# EAGLE board PCB-CMB-6 (EAGLE 7.2.0), part 1 of 2
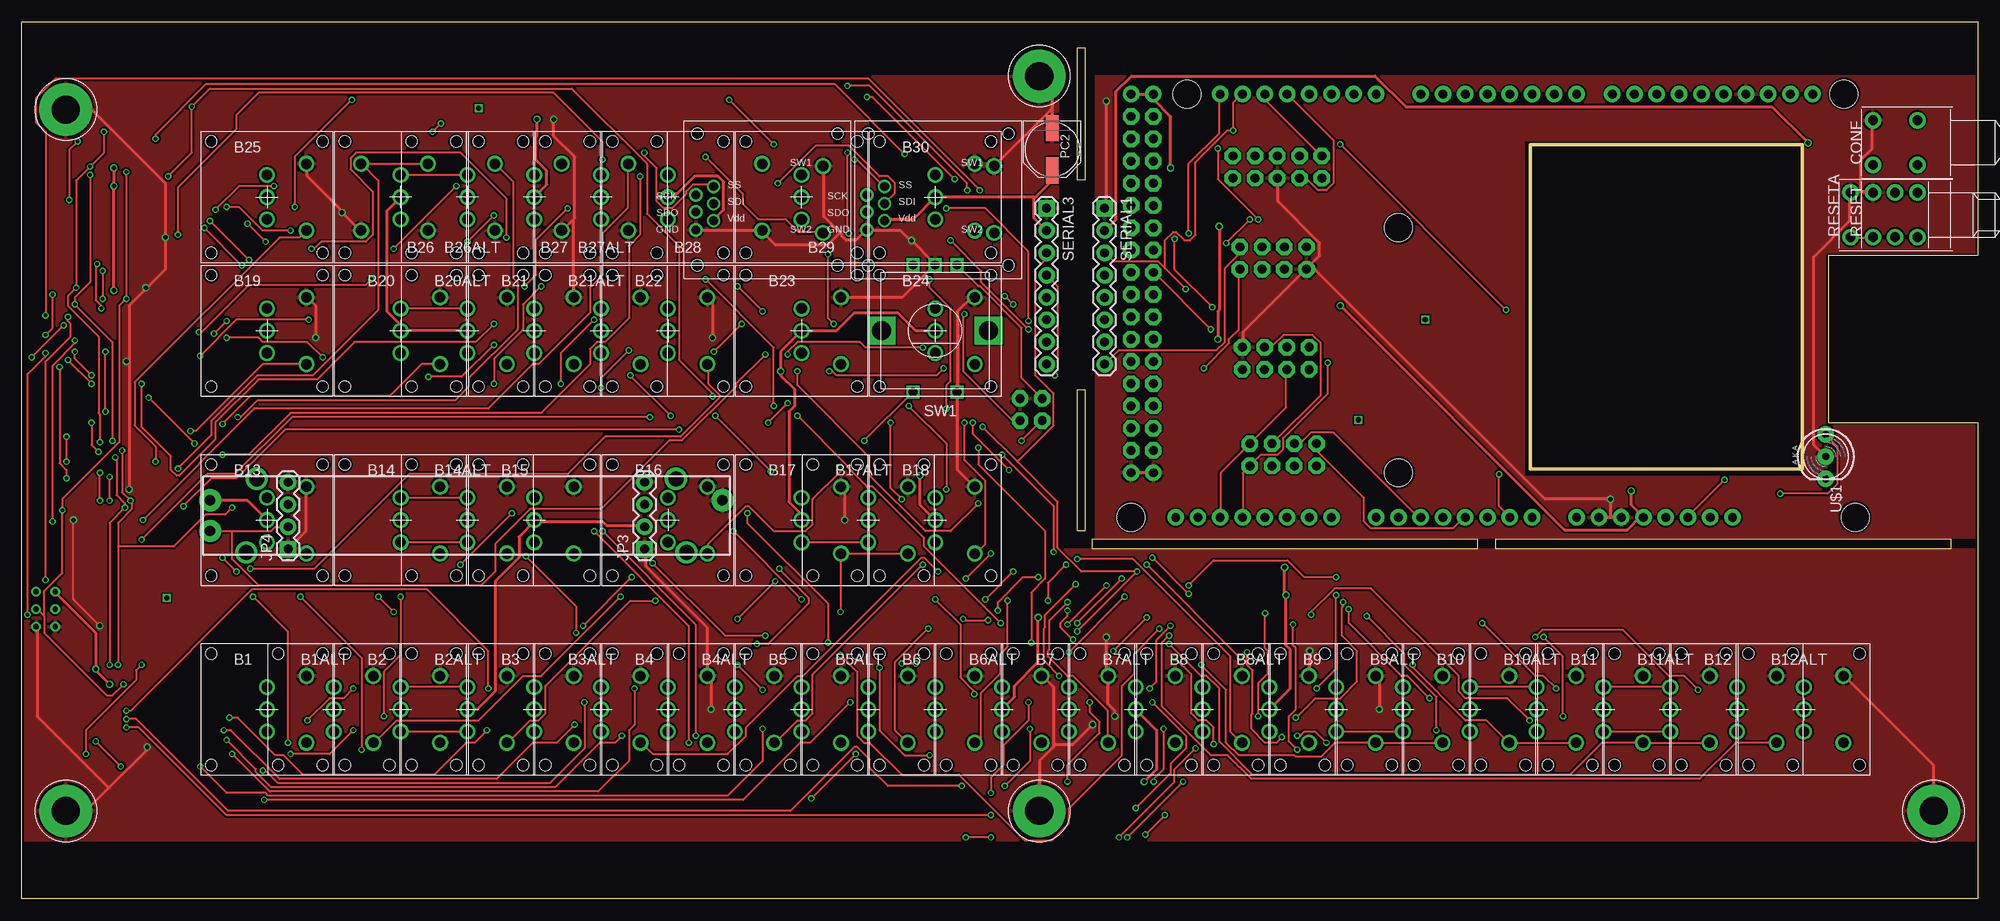
[diagram p7: board, top side]
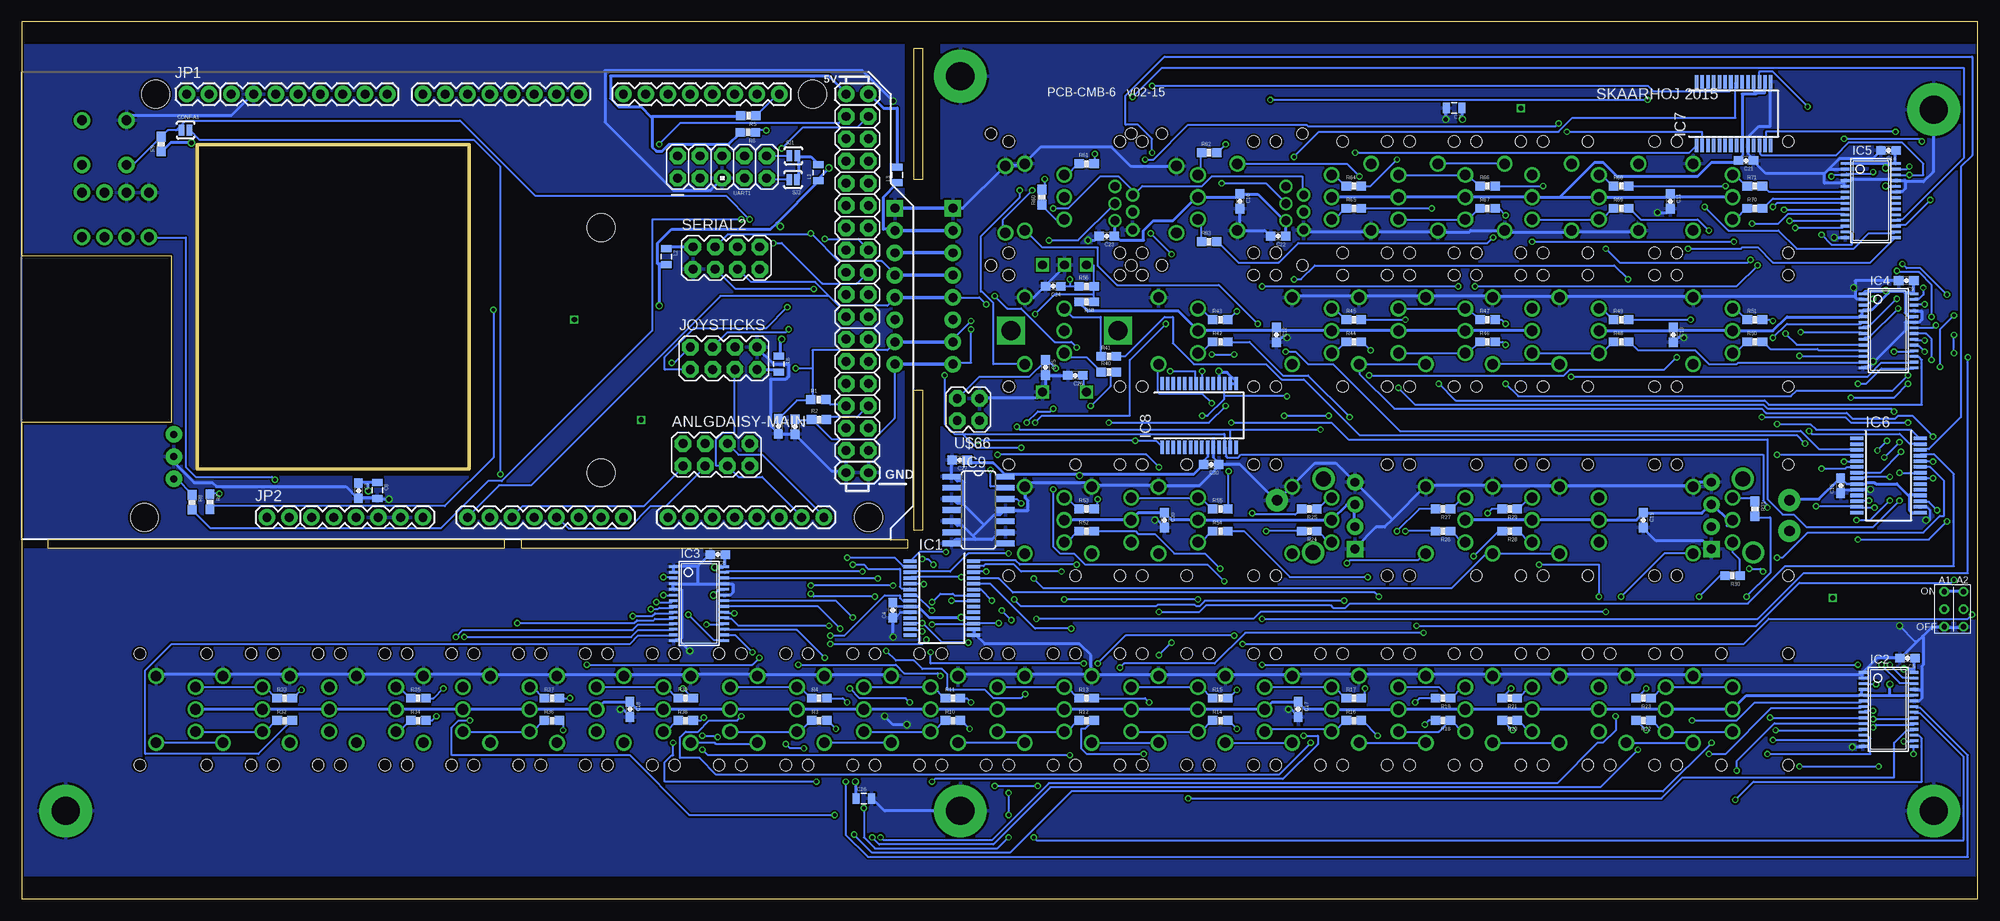
[diagram p8: board, bottom side, seen from below]

Size 223 x 100 mm. Coordinates in mm from the lower left corner, seen from the top.
Outline: 0,0 0,100 223,100 223,73.32 206,73.32 206,54.32 223,54.32 223,0 0,0
Copper layers (1*16): Top 0.035mm / dielectric 1.5mm / Bottom 0.035mm
Design rules "Fusion_eagle_rule_v1.1": minimum track width 6mil, minimum drill 12mil, track to track 6mil, track to pad 6mil, pad to pad 6mil, via to via 6mil, smd to smd 0mil, copper to edge 10mil, drill to drill 10mil, minimum pad ring 10mil, minimum via ring 6mil, stop-mask expansion 2mil, vias tented up to drill 100mil, thermal gap 10mil
Net classes: 0 default: width 0.203 mm, drill 0.406 mm, clearance 0.203 mm; 1 Power: width 0.356 mm, drill 0.508 mm, clearance 0.203 mm
tRestrict: area 0,0 to 223,6.5; area 0,94 to 223,100; area 118.3,40 to 122.3,100; area 121,40 to 223,41; area 171.4,48.3 to 203.2,86.4
bRestrict: area 0,97.5 to 223,100; area 0,0 to 223,2.5; area 118.3,40 to 122.3,100; area 121,40 to 223,41; area 171.4,48.3 to 203.2,86.4
Milling: area 168,40 to 220,41; area 120.3,82 to 121.3,97; area 120.3,42 to 121.3,58; area 122,40 to 166,41; 4 lines

## Footprints (pad centres in the part's own frame; a part is rotated, then mirrored left to right if it is on the bottom)
2X4 = drill 1.016 pad 1.88 octagon: 1 -3.81,-1.27; 2 -3.81,1.27; 3 -1.27,-1.27; 4 -1.27,1.27; 5 1.27,-1.27; 6 1.27,1.27; 7 3.81,-1.27; 8 3.81,1.27
LP11 = drill 1.2: COM 0,0; P$2 0,2.54; P$3 0,-2.54; P$4 4.5,3.81; P$5 4.5,-3.81 | hole 1.3: -6.35,6.35; 6.35,6.35; 6.35,-6.35; -6.35,-6.35
0603-CAP = smd 1.1 x 1: 1 -0.85,0; 2 0.85,0
0805 = smd 0.8 x 1.2: 1 -0.9,0; 2 0.9,0
PUSHBUTTON = drill 1.1 pad 1.88: 1 2.54,2.54; 2 2.54,-2.54; 3 -2.54,2.54; 4 -2.54,-2.54
SJ_2S-NO = smd 0.635 x 1.27: 1 -0.45,0; 2 0.45,0
SSOP28 = smd 0.4 x 1.5: 1 -4.225,-3.625; 2 -3.575,-3.625; 3 -2.925,-3.625; 4 -2.275,-3.625; 5 -1.625,-3.625; 6 -0.975,-3.625; 7 -0.325,-3.625; 8 0.325,-3.625; 9 0.975,-3.625; 10 1.625,-3.625; 11 2.275,-3.625; 12 2.925,-3.625; 13 3.575,-3.625; 14 4.225,-3.625; 15 4.225,3.625; 16 3.575,3.625; 17 2.925,3.625; 18 2.275,3.625; 19 1.625,3.625; 20 0.975,3.625; 21 0.325,3.625; 22 -0.325,3.625; 23 -0.975,3.625; 24 -1.625,3.625; 25 -2.275,3.625; 26 -2.925,3.625; 27 -3.575,3.625; 28 -4.225,3.625
TSSOP28 = smd 0.305 x 0.991: 1 -4.225,-2.918; 2 -3.575,-2.918; 3 -2.925,-2.918; 4 -2.275,-2.918; 5 -1.625,-2.918; 6 -0.975,-2.918; 7 -0.325,-2.918; 8 0.325,-2.918; 9 0.975,-2.918; 10 1.625,-2.918; 11 2.275,-2.918; 12 2.925,-2.918; 13 3.575,-2.918; 14 4.225,-2.918; 15 4.225,2.918; 16 3.575,2.918; 17 2.925,2.918; 18 2.275,2.918; 19 1.625,2.918; 20 0.975,2.918; 21 0.325,2.918; 22 -0.325,2.918; 23 -0.975,2.918; 24 -1.625,2.918; 25 -2.275,2.918; 26 -2.925,2.918; 27 -3.575,2.918; 28 -4.225,2.918
SO14 = smd 0.66 x 2.032: 1 -3.81,-3.073; 2 -2.54,-3.073; 3 -1.27,-3.073; 4 0,-3.073; 5 1.27,-3.073; 6 2.54,-3.073; 7 3.81,-3.073; 8 3.81,3.073; 9 2.54,3.073; 10 1.27,3.073; 11 0,3.073; 12 -1.27,3.073; 13 -2.54,3.073; 14 -3.81,3.073
1X02 = drill 1.016 pad 1.88: 1 0,0; 2 2.54,0
1X04 = drill 1.016 pad 1.88 square: 1 0,0 | drill 1.016 pad 1.88: 2 2.54,0; 3 5.08,0; 4 7.62,0
PANASONIC_D = smd 3 x 1.4: + 2.4,0; - -2.4,0
SLIDER45 = drill 1.194 pad 2.54: 1 -29.21,1.75; 2A -29.21,-1.75; 3 29.21,1.75 | drill 1.702: P$1 -23.9,4.2; P$2 23.9,4.2; P$3 25.1,-4.2; P$4 -25.1,-4.2
0603-RES = smd 1.1 x 1: 1 -0.85,0; 2 0.85,0
1X08 = drill 1.016 pad 1.88 square: 1 0,0 | drill 1.016 pad 1.88: 2 2.54,0; 3 5.08,0; 4 7.62,0; 5 10.16,0; 6 12.7,0; 7 15.24,0; 8 17.78,0
SMART_SWITCH = drill 1.2: 1 6.35,3.81; 2 6.35,-3.81 | drill 1: 3 -8.153,-3.48; 4 -6.147,-2.413; 5 -8.153,-1.422; 6 -6.147,-0.483; 7 -8.153,0.508; 8 -6.147,1.499 | hole 1.3: -8.001,7.506; 8.001,7.506; 8.001,-7.506; -8.001,-7.506
ALPS_EC12E_SW = drill 1 square: A -2.5,-7.5; B 2.5,-7.5; C 0,-7.5; D -2.5,7; E 2.5,7 | drill 2.2 square: GND1 -6.1,0; GND2 6.1,0
ARDUINO_MEGA = drill 1.016 pad 1.88: 0 63.5,50.8; 1 60.96,50.8; 2 58.42,50.8; 3 55.88,50.8; 3.3V 35.56,2.54; 4 53.34,50.8; 5 50.8,50.8; 5V@0 38.1,2.54; 5V@1 93.98,50.8; 5V@2 96.52,50.8; 6 48.26,50.8; 7 45.72,50.8; 8 41.656,50.8; 9 39.116,50.8; 10 36.576,50.8; 11 34.036,50.8; 12 31.496,50.8; 13 28.956,50.8; 14 68.58,50.8; 15 71.12,50.8; 16 73.66,50.8; 17 76.2,50.8; 18 78.74,50.8; 19 81.28,50.8; 20 83.82,50.8; 21 86.36,50.8; A0 50.8,2.54; A1 53.34,2.54; A2 55.88,2.54; A3 58.42,2.54; A4 60.96,2.54; A5 63.5,2.54; A6 66.04,2.54; A7 68.58,2.54; A8 73.66,2.54; A9 76.2,2.54; A10 78.74,2.54; A11 81.28,2.54; A12 83.82,2.54; A13 86.36,2.54; A14 88.9,2.54; A15 91.44,2.54; AREF 23.876,50.8; GND@0 40.64,2.54; GND@1 43.18,2.54; GND@2 93.98,7.62; GND@3 96.52,7.62; GND@4 26.416,50.8; RESET 33.02,2.54; VIN 45.72,2.54 | drill 1.016 pad 1.88 octagon: 22 93.98,48.26; 23 96.52,48.26; 24 93.98,45.72; 25 96.52,45.72; 26 93.98,43.18; 27 96.52,43.18; 28 93.98,40.64; 29 96.52,40.64; 30 93.98,38.1; 31 96.52,38.1; 32 93.98,35.56; 33 96.52,35.56; 34 93.98,33.02; 35 96.52,33.02; 36 93.98,30.48; 37 96.52,30.48; 38 93.98,27.94; 39 96.52,27.94; 40 93.98,25.4; 41 96.52,25.4; 42 93.98,22.86; 43 96.52,22.86; 44 93.98,20.32; 45 96.52,20.32; 46 93.98,17.78; 47 96.52,17.78; 48 93.98,15.24; 49 96.52,15.24; 50 93.98,12.7; 51 96.52,12.7; 52 93.98,10.16; 53 96.52,10.16 | hole 3.2: 15.24,50.8; 13.97,2.54; 66.04,35.56; 66.04,7.62; 90.17,50.8; 96.52,2.54
LED5MM-BICOLOR = drill 0.813 pad 1.88: A2 2.54,0; A3 -2.54,0; K1 0,0
3.2MMPAD6MM = drill 3.2 pad 6: P$1 0,0
2BITADDR = drill 0.6: A1 0,0; A2 2.2,0; H2 0,2; H3 2.2,2; L2 0,-2; L3 2.2,-2
2X2 = drill 1.016 pad 1.88 octagon: 1 -3.81,-1.27; 2 -3.81,1.27; 3 -1.27,-1.27; 4 -1.27,1.27
AVR_ICSP = drill 1.016 pad 1.88 octagon: 1 -1.27,5.08; 2 1.27,5.08; 3 -1.27,2.54; 4 1.27,2.54; 5 -1.27,0; 6 1.27,0; 7 -1.27,-2.54; 8 1.27,-2.54; 9 -1.27,-5.08; 10 1.27,-5.08

## Placement (x,y rotation side)
ANLGDAISY-MAIN  M04X2  [2X4]  143.82,50.62 0 bottom
B1  LP11-B"  [LP11]  27.94,21.59 0 top
B1ALT  LP11-B"  [LP11]  35.56,21.59 0 top
B2  LP11-B"  [LP11]  43.18,21.59 0 top
B2ALT  LP11-B"  [LP11]  50.8,21.59 0 top
B3  LP11-B"  [LP11]  58.42,21.59 0 top
B3ALT  LP11-B"  [LP11]  66.04,21.59 0 top
B4  LP11-B"  [LP11]  73.66,21.59 0 top
B4ALT  LP11-B"  [LP11]  81.28,21.59 0 top
B5  LP11-B"  [LP11]  88.9,21.59 0 top
B5ALT  LP11-B"  [LP11]  96.52,21.59 0 top
B6  LP11-B"  [LP11]  104.14,21.59 0 top
B6ALT  LP11-B"  [LP11]  111.76,21.59 0 top
B7  LP11-B"  [LP11]  119.38,21.59 0 top
B7ALT  LP11-B"  [LP11]  127,21.59 0 top
B8  LP11-B"  [LP11]  134.62,21.59 0 top
B8ALT  LP11-B"  [LP11]  142.24,21.59 0 top
B9  LP11-B"  [LP11]  149.86,21.59 0 top
B9ALT  LP11-B"  [LP11]  157.48,21.59 0 top
B10  LP11-B"  [LP11]  165.1,21.59 0 top
B10ALT  LP11-B"  [LP11]  172.72,21.59 0 top
B11  LP11-B"  [LP11]  180.34,21.59 0 top
B11ALT  LP11-B"  [LP11]  187.96,21.59 0 top
B12  LP11-B"  [LP11]  195.58,21.59 0 top
B12ALT  LP11-B"  [LP11]  203.2,21.59 0 top
B13  LP11-B"  [LP11]  27.94,43.18 0 top
B14  LP11-B"  [LP11]  43.18,43.18 0 top
B14ALT  LP11-B"  [LP11]  50.8,43.18 0 top
B15  LP11-B"  [LP11]  58.42,43.18 0 top
B16  LP11-B"  [LP11]  73.66,43.18 0 top
B17  LP11-B"  [LP11]  88.9,43.18 0 top
B17ALT  LP11-B"  [LP11]  96.52,43.18 0 top
B18  LP11-B"  [LP11]  104.14,43.18 0 top
B19  LP11-B"  [LP11]  27.94,64.77 0 top
B20  LP11-B"  [LP11]  43.18,64.77 0 top
B20ALT  LP11-B"  [LP11]  50.8,64.77 0 top
B21  LP11-B"  [LP11]  58.42,64.77 0 top
B21ALT  LP11-B"  [LP11]  66.04,64.77 0 top
B22  LP11-B"  [LP11]  73.66,64.77 0 top
B23  LP11-B"  [LP11]  88.9,64.77 0 top
B24  LP11-B"  [LP11]  104.14,64.77 0 top
B25  LP11-B"  [LP11]  27.94,80.01 0 top
B26  LP11-B"  [LP11]  43.18,80.01 180 top
B26ALT  LP11-B"  [LP11]  50.8,80.01 180 top
B27  LP11-B"  [LP11]  58.42,80.01 180 top
B27ALT  LP11-B"  [LP11]  66.04,80.01 180 top
B28  LP11-B"  [LP11]  73.66,80.01 180 top
B29  LP11-B"  [LP11]  88.9,80.01 180 top
B30  LP11-B"  [LP11]  104.14,80.01 0 top
C1  220pF?  [0603-CAP]  136.75,53.89 270 bottom
C2  220pF?  [0603-CAP]  134.84,53.82 270 bottom
C3  100nF  [0603-CAP]  184.63,46.52 270 bottom
C4  100nF  [0603-CAP]  123.7,32.89 90 bottom
C5  100nF  [0603-CAP]  8,27.43 180 bottom
C6  22uF  [0805]  182.47,46.57 270 bottom
C7  22uF  [0805]  59.69,90.17 180 bottom
C8  100nF  [0603-CAP]  143.64,39.24 180 bottom
C9  100nF  [0603-CAP]  8.13,70.48 180 bottom
C10  100nF  [0603-CAP]  84.12,79.55 270 bottom
C11  100nF  [0603-CAP]  35.05,79.55 270 bottom
C12  100nF  [0603-CAP]  79.96,64.31 270 bottom
C13  100nF  [0603-CAP]  34.7,64.31 270 bottom
C14  100nF  [0603-CAP]  10.16,85.34 180 bottom
C15  100nF  [0603-CAP]  15.62,47.12 90 bottom
C16  22uF  [0805]  127,11.43 0 bottom
C17  100nF  [0603-CAP]  77.47,21.59 270 bottom
C18  100nF  [0603-CAP]  153.67,21.59 270 bottom
C19  100nF  [0603-CAP]  38.1,43.18 270 bottom
C20  100nF  [0603-CAP]  92.71,43.18 270 bottom
C21  100nF  [0603-CAP]  26.42,84.2 180 bottom
C22  100nF  [0603-CAP]  79.76,75.56 180 bottom
C23  100nF  [0603-CAP]  99.31,75.56 180 bottom
C24  10nF  [0603-CAP]  105.41,69.85 180 bottom
C25  10nF  [0603-CAP]  106.3,60.58 270 bottom
C26  10nF  [0603-CAP]  102.87,59.69 180 bottom
C27  100nF  [0603-CAP]  116.08,50.04 180 bottom
C30  100nF  [0603-CAP]  87.38,49.53 180 bottom
CONF  [PUSHBUTTON]  213.6,86.25 90 top
CONF-A1  SOLDERJUMPERNO  [SJ_2S-NO]  204.34,87.66 0 bottom
IC1  MCP23017SS  [SSOP28]  118.11,34.29 270 bottom
IC2  PCA9685  [TSSOP28]  10.16,21.59 270 bottom
IC3  PCA9685  [TSSOP28]  145.8,33.66 270 bottom
IC4  PCA9685  [TSSOP28]  10.16,64.77 270 bottom
IC5  PCA9685  [TSSOP28]  12.19,79.63 270 bottom
IC6  MCP23017SS  [SSOP28]  10.16,48.26 270 bottom
IC7  MCP23017SS  [SSOP28]  27.81,89.53 0 bottom
IC8  MCP23017SS  [SSOP28]  88.77,55.12 0 bottom
IC9  74HCT14D  [SO14]  113.92,44.32 270 bottom
JOYSTICKS  M04X2  [2X4]  142.97,61.64 0 bottom
JP1  [1X02]  204.2,91.76 0 bottom
JP2  [1X02]  195.06,43.5 0 bottom
JP3  [1X04]  70.99,39.88 90 top
JP4  [1X04]  30.35,39.88 90 top
L1  [0805]  132.19,82.81 90 bottom
L2  [0805]  149.5,73.23 270 bottom
L3  [0805]  123.19,82.55 90 bottom
L6  [0805]  136.67,60.97 270 bottom
PC2  47u  [PANASONIC_D]  117.47,85.47 270 top
POT1  SLIDER45  [SLIDER45]  50.67,43.69 0 top
R1  ?  [0603-RES]  132.18,56.93 0 bottom
R2  ?  [0603-RES]  132.12,54.64 0 bottom
R3  270  [0603-RES]  132.08,20.32 0 bottom
R4  270  [0603-RES]  132.08,22.86 0 bottom
R5  1K5  [0603-RES]  140.16,89.3 180 bottom
R6  1K5  [0603-RES]  140.22,87.39 180 bottom
R7  270R  [0603-RES]  201.57,45.26 270 bottom
R8  270R  [0603-RES]  203.6,45.2 270 bottom
R9  10K  [0603-RES]  207.12,86.06 90 bottom
R10  270  [0603-RES]  116.84,20.32 0 bottom
R11  270  [0603-RES]  116.84,22.86 0 bottom
R12  270  [0603-RES]  101.6,20.32 0 bottom
R13  270  [0603-RES]  101.6,22.86 0 bottom
R14  270  [0603-RES]  86.36,20.32 0 bottom
R15  270  [0603-RES]  86.36,22.86 0 bottom
R16  270  [0603-RES]  71.12,20.32 0 bottom
R17  270  [0603-RES]  71.12,22.86 0 bottom
R18  270  [0603-RES]  60.96,20.32 180 bottom
R19  270  [0603-RES]  60.96,22.86 180 bottom
R20  270  [0603-RES]  53.34,20.32 180 bottom
R21  270  [0603-RES]  53.34,22.86 180 bottom
R22  270  [0603-RES]  38.1,20.32 180 bottom
R23  270  [0603-RES]  38.1,22.86 180 bottom
R24  270  [0603-RES]  76.2,41.91 180 bottom
R25  270  [0603-RES]  76.2,44.45 180 bottom
R26  270  [0603-RES]  60.96,41.91 180 bottom
R27  270  [0603-RES]  60.96,44.45 180 bottom
R28  270  [0603-RES]  53.34,41.91 180 bottom
R29  270  [0603-RES]  53.34,44.45 180 bottom
R30  270  [0603-RES]  27.94,36.83 180 bottom
R31  270  [0603-RES]  25.4,44.45 270 bottom
R32  270  [0603-RES]  193.04,20.32 0 bottom
R33  270  [0603-RES]  193.04,22.86 0 bottom
R34  270  [0603-RES]  177.8,20.32 0 bottom
R35  270  [0603-RES]  177.8,22.86 0 bottom
R36  270  [0603-RES]  162.56,20.32 0 bottom
R37  270  [0603-RES]  162.56,22.86 0 bottom
R38  270  [0603-RES]  147.32,20.32 0 bottom
R39  270  [0603-RES]  147.32,22.86 0 bottom
R40  270  [0603-RES]  99.06,60.07 0 bottom
R41  270  [0603-RES]  99.06,61.85 0 bottom
R42  270  [0603-RES]  86.36,63.5 0 bottom
R43  270  [0603-RES]  86.36,66.04 0 bottom
R44  270  [0603-RES]  71.12,63.5 0 bottom
R45  270  [0603-RES]  71.12,66.04 0 bottom
R46  270  [0603-RES]  55.88,63.5 0 bottom
R47  270  [0603-RES]  55.88,66.04 0 bottom
R48  270  [0603-RES]  40.64,63.5 0 bottom
R49  270  [0603-RES]  40.64,66.04 0 bottom
R50  270  [0603-RES]  25.4,63.5 0 bottom
R51  270  [0603-RES]  25.4,66.04 0 bottom
R52  270  [0603-RES]  101.6,41.91 0 bottom
R53  270  [0603-RES]  101.6,44.45 0 bottom
R54  270  [0603-RES]  86.36,41.91 0 bottom
R55  270  [0603-RES]  86.36,44.45 0 bottom
R56  0R  [0603-RES]  101.6,69.85 0 bottom
R58  100K  [0603-RES]  101.6,68.07 180 bottom
R60  270  [0603-RES]  106.68,80.01 90 bottom
R61  270  [0603-RES]  101.6,83.82 0 bottom
R62  270  [0603-RES]  87.63,85.09 0 bottom
R63  270  [0603-RES]  87.63,74.93 0 bottom
R64  270  [0603-RES]  71.12,81.28 0 bottom
R65  270  [0603-RES]  71.12,78.74 0 bottom
R66  270  [0603-RES]  55.88,81.28 0 bottom
R67  270  [0603-RES]  55.88,78.74 0 bottom
R68  270  [0603-RES]  40.64,81.28 0 bottom
R69  270  [0603-RES]  40.64,78.74 0 bottom
R70  270  [0603-RES]  25.4,78.74 0 bottom
R71  270  [0603-RES]  25.4,81.28 0 bottom
RESET  [PUSHBUTTON]  213.6,77.99 90 top
RESETA  [PUSHBUTTON]  211.06,77.99 90 top
SERIAL1  [1X08]  123.44,78.74 270 top
SERIAL2  M04X2  [2X4]  142.68,73.07 0 bottom
SERIAL3  [1X08]  116.84,78.74 270 top
SJ1  SOLDERJUMPERNO  [SJ_2S-NO]  135.03,84.74 0 bottom
SJ2  SOLDERJUMPERNO  [SJ_2S-NO]  135.07,82.01 180 bottom
SSW1  SMART_SWITCHSMART_SWITCH_8PIN  [SMART_SWITCH]  85,79.75 0 top
SSW2  SMART_SWITCHSMART_SWITCH_8PIN  [SMART_SWITCH]  104.5,79.75 0 top
SW1  EC12E_SW  [ALPS_EC12E_SW]  104.12,64.79 180 top
U1  ARDUINO-MEGAFULL  [ARDUINO_MEGA]  223,40.96 0 bottom
U$1  LEDBICOLOR-AKA  [LED5MM-BICOLOR]  205.69,50.41 270 top
U$7  GNDPAD6MM  [3.2MMPAD6MM]  218,10 0 top
U$15  GNDPAD6MM  [3.2MMPAD6MM]  116,10 0 top
U$18  GNDPAD6MM  [3.2MMPAD6MM]  116,93.81 0 top
U$20  GNDPAD6MM  [3.2MMPAD6MM]  5,10 0 top
U$21  GNDPAD6MM  [3.2MMPAD6MM]  5,90 0 top
U$34  2BITADDR  [2BITADDR]  3.81,33.02 0 bottom
U$66  M02X2  [2X2]  117.62,55.79 180 bottom
UART1  M05X2PTH  [AVR_ICSP]  143.15,83.45 90 bottom

## Tracks (layer width: path | path; a pad name or v marks a point on that pad's centre or on a via)
5V  (via drill 0.51)
  Top 0.356: U$34.H2 3.81,34.92 8.41,30.32 v8.41,26.19 8.41,26.04 v10,24.45 | B8ALT.COM 144.62,23.97 144.62,28.42 144.15,28.89 v144.15,34.61 143.99,34.61 v143.99,37.78 | v127.95,13.34 129.38,14.76 129.38,19.21 B7ALT.COM | v115.89,32.07 115.89,26.99 113.19,24.29 113.19,23.02 B6ALT.COM | v102.39,48.26 102.39,44.93 B18.COM | B13.COM 25.72,45.4 21.59,45.4 POT1.1 | v10.48,83.34 v10.48,81.28 v10.48,69.37 | B24.COM 101.92,64.77 99.85,66.83 94.93,66.83 92.87,64.77 B23.COM 86.52,62.39 v86.52,60.17 86.52,59.69 88.11,58.1 88.11,56.2 87.47,55.56 87.47,45.24 88.9,43.81 B17.COM | B20ALT.COM B20.COM 43.18,65.41 41.59,66.99 41.59,78.42 B26.COM | v58.74,88.9 58.74,87 58.58,86.84 58.58,84.3 59.85,83.03 59.85,81.44 B27.COM | SSW2.4 98.42,77.47 101.6,77.47 B30.COM 115.41,80.01 115.49,79.93 | v203.68,86.2 199.55,90.33 157.8,90.33 154.31,93.82 126.52,93.82 124.78,92.08 124.78,77.47 123.51,76.2 SERIAL1.2 | PC2.+ 117.47,81.92 115.49,79.93 | 115.49,79.93 115.41,79.85 115.41,77.63 SERIAL3.2 | B28.COM 74.3,80.01 76.68,82.39 79.38,82.39 80.01,81.76 80.01,78.58 78.9,77.47 SSW1.4 | B2ALT.COM 51.91,21.59 53.98,23.65 53.98,36.2 56.67,38.89 56.67,41.27 58.42,43.02 B15.COM 58.58,43.02 66.2,43.02 66.67,42.55 70.96,42.55 JP3.2
  Bottom 0.305: C21.2 27.27,84.37 26.8,84.84 26.8,85.87 IC7.9 | IC6.9 14.94,47.28 C15.2 | C30.2 88.23,49.95 87.76,50.42 87.76,51.45 IC8.9 | IC1.9 123.27,33.31 C4.2
  Bottom 0.356: 7.3,26.19 7.3,27.3 C5.1 | 7.3,26.19 7.3,25.88 IC2.28 | v8.41,26.19 7.3,26.19 | U$34.H3 1.75,35.08 3.81,35.08 U$34.H2 | 10,23.18 13.02,23.18 IC2.5 | 10,23.18 7.3,23.18 IC2.24 | IC2.4 13.18,23.81 13.18,23.34 IC2.5 | IC2.5 13.34,23.34 13.49,23.18 26.35,23.18 B1.COM B1ALT.COM B2.COM B2ALT.COM B3.COM B3ALT.COM B4.COM 76.68,21.59 77.47,22.38 C17.1 77.63,22.38 80.49,22.38 B4ALT.COM B5.COM B5ALT.COM B6.COM B6ALT.COM B7.COM B7ALT.COM B8.COM B8ALT.COM B9.COM 152.88,21.59 153.67,22.38 C18.1 153.83,22.38 156.69,22.38 B9ALT.COM B10.COM B10ALT.COM B11.COM B11ALT.COM B12.COM B12ALT.COM | 10,23.18 v10,24.45 | C8.1 142.88,39.21 142.88,37.94 IC3.28 143.03,37.78 v143.99,37.78 | v144.15,34.61 143.51,35.24 143.03,35.24 IC3.24 | v127.95,13.34 127.95,11.43 C16.1 | IC1.18 114.62,32.07 v115.89,32.07 119.54,32.07 120.81,33.34 121.6,33.34 IC1.9 | C27.1 115.09,50.01 114.78,49.69 112.24,49.69 110.81,48.26 IC9.14 110.81,48.42 102.39,48.42 | 102.39,48.42 89.38,48.42 88.27,49.53 C30.2 | 71.12,44.93 JP3.3 | B18.COM B17ALT.COM 95.73,43.97 92.87,43.97 C20.1 92.71,43.97 91.92,43.18 B17.COM B16.COM 71.91,44.93 71.28,44.93 JP3.3 | v102.39,48.26 102.39,48.42 | 7.78,46.04 7.78,44.29 7.46,43.97 6.67,43.97 IC6.15 | 7.78,46.04 6.67,46.04 IC6.18 | C15.2 15.72,47.94 18.1,45.56 21.43,45.56 POT1.1 | 7.78,46.04 7.94,46.04 9.21,47.31 11.59,47.31 11.75,47.47 12.7,47.47 12.86,47.31 13.65,47.31 IC6.9 | 28.57,42.55 B13.COM 28.26,43.02 30.16,44.93 JP4.3 | 30.32,44.93 JP4.3 | C19.1 38.1,43.97 38.89,43.18 B14.COM B14ALT.COM B15.COM | 37.94,43.97 C19.1 | v10.48,81.28 9.37,81.28 IC5.24 | 10.08,83.74 10,83.82 9.37,83.82 IC5.28 9.37,83.98 9.37,85.25 C14.1
  Bottom 0.356: 10.08,83.74 v10.48,83.34 | IC5.1 15.08,83.82 10.16,83.82 10.08,83.74 | 8.26,69.06 8.26,66.83 7.78,66.36 7.3,66.36 IC4.24 | 7.3,69.06 8.26,69.06 | 7.3,69.06 IC4.28 | 10.16,69.22 8.26,69.22 8.26,69.06 | 10.16,69.22 10.48,69.22 | 10.48,69.22 12.86,69.22 13.02,69.06 IC4.1 | 7.3,69.06 7.3,70.48 C9.1 | 10.16,69.22 10.16,69.06 12.06,67.15 13.02,67.15 IC4.4 13.18,66.99 13.18,66.52 IC4.5 13.34,66.52 13.49,66.36 21.75,66.36 23.34,64.77 B19.COM 34.29,64.77 34.61,65.09 C13.1 34.77,65.09 35.08,64.77 B20.COM | v10.48,69.37 10.48,69.22 | IC8.16 85.09,58.74 84.61,58.74 IC8.15 84.45,58.9 85.57,60.01 86.52,60.01 | 86.52,60.01 86.52,58.9 IC8.18 | R58.2 102.39,67.94 101.44,66.99 91.12,66.99 B23.COM 79.69,64.77 C12.1 79.85,65.09 79.53,64.77 B22.COM B21ALT.COM B21.COM B20ALT.COM | v86.52,60.17 86.52,60.01 | v58.74,88.9 58.74,90.17 C7.1 | B28.COM B27ALT.COM B27.COM B26ALT.COM 47.47,80.01 | B25.COM 34.61,80.01 34.92,80.33 C11.1 35.08,80.33 35.4,80.01 B26.COM 47.47,80.01 | 25.24,91.92 24.29,91.92 24.29,93.03 IC7.16 | 25.24,91.92 25.56,92.23 25.56,93.03 IC7.18 | IC7.9 26.83,86.04 26.83,91.76 25.24,91.76 25.24,91.92 | C21.2 27.3,84.14 27.46,83.98 30.32,83.98 31.91,82.39 41.12,82.39 42.7,83.98 43.66,83.98 47.47,80.17 47.47,80.01 | C22.1 78.9,77.31 SSW1.4 79.06,77.31 82.07,80.33 83.98,80.33 C10.1 84.14,80.33 84.45,80.01 B29.COM 89.06,80.01 91.76,77.31 93.98,77.31 95.09,76.2 95.09,75.09 97.79,75.09 98.27,75.56 C23.1 98.42,75.56 98.42,77.31 SSW2.4 | v203.68,86.2 206.06,86.2 207.01,85.25 R9.1 | L3.1 123.19,81.6 124.78,80.01 124.78,76.36 123.51,76.36 SERIAL1.2 | JP3.2 71.12,42.55 71.12,44.77 JP3.3
  Bottom 0.356: JP4.3 30.48,44.93 31.43,43.97 37.78,43.97 C19.1
  Bottom 0.406: SERIAL3.2 SERIAL1.2
5V_RAW  (via drill 0.51)
  Top 0.356: U1.5V@2 126.52,91.76 128.91,91.76 U1.5V@1 129.06,91.6 129.06,91.12 130.97,89.22 v130.97,83.34 | v183.51,46.51 183.51,44.93 184.78,43.66 U1.5V@0 184.63,43.66 183.04,42.07 175.9,42.07 v150.34,67.63 | v136.37,63.82 136.37,66.99 136.53,67.15 v136.53,76.68
  Bottom 0.356: 151.13,89.22 151.13,85.72 150.65,85.25 150.02,85.25 149.22,86.04 142.4,86.04 141.13,87.31 R6.2 | 151.13,89.22 141.13,89.22 R5.2 | L3.2 123.19,90.17 124.78,90.17 126.36,91.76 U1.5V@2 | 151.13,89.22 151.29,89.22 152.4,90.33 154.94,90.33 155.89,91.28 155.89,93.82 130.97,93.82 129.06,91.92 U1.5V@1 | 183.51,47.47 182.56,47.47 C6.1 | 183.51,47.47 184.63,47.47 C3.1 | v183.51,46.51 183.51,47.47 | 136.92,77.07 137.64,76.36 148.91,76.36 150.5,74.77 150.5,72.39 150.34,72.39 | 136.92,77.07 132.24,81.76 L1.1 132.24,82.07 v130.97,83.34 | 150.34,72.39 149.54,72.39 L2.2 | v136.37,63.82 136.53,63.82 136.53,61.91 L6.1 | 136.92,77.07 v136.53,76.68 | 150.34,72.39 v150.34,67.63
A0  (via drill 0.41)
  Top 0.203: 23.97,41.91 21.59,41.91 POT1.2A | 23.97,41.91 28.42,41.91 28.89,42.39 30.32,42.39 JP4.2 | 23.97,41.91 23.97,38.73 26.99,35.72 52.39,35.72 53.98,37.31 53.98,40.48 57.94,44.45 66.04,44.45 73.82,52.23 75.25,52.23 81.44,58.42 81.44,58.74 v84.77,62.07 | v87.31,62.07 87.31,62.39 88.42,63.5 95.57,63.5 96.2,62.87 v102.71,62.87 | v113.03,67.79 v112.08,68.74
  Bottom 0.203: 130.97,68.74 129.86,67.63 124.3,67.63 123.51,68.42 SERIAL1.5 | 130.97,68.74 132.56,70.33 139.86,70.33 141.29,71.75 SERIAL2.5 | 130.97,68.74 143.35,68.74 164.94,47.15 168.59,47.15 172.09,43.66 U1.A0 | v87.31,62.07 v84.77,62.07 | v102.71,62.87 103.35,63.5 105.25,63.5 109.06,67.31 110.65,67.31 v112.08,68.74 | v113.03,67.79 113.82,68.58 SERIAL3.5
  Bottom 0.406: SERIAL3.5 SERIAL1.5
A1  (via drill 0.41)
  Top 0.203: v168.43,48.42 168.43,44.77 169.54,43.66 U1.A1
  Bottom 0.203: v168.43,48.42 168.43,83.5 171.45,86.52 202.72,86.52 203.84,87.63 CONF-A1.2
A2  (via drill 0.41)
  Top 0.203: v149.86,36.67 146.21,36.67 144.3,38.58 135.89,38.58 v133.03,35.72 | v119.22,31.27 v123.67,35.72 | v88.42,55.09 94.14,49.37 94.14,49.21 96.36,46.99 97,46.99 102.87,41.12 102.87,40.16 v111.6,31.43 | v11.59,24.45 10.32,23.18 9.68,23.18 2.54,30.32 2.54,32.23 | 2.54,32.23 1.75,33.02 U$34.A2 | 2.54,32.23 2.54,35.08 4.6,37.15 v4.6,44.29 4.6,45.56 11.11,52.07 11.11,67.63 v11.91,68.42 v11.91,82.87 | v16.67,82.39 19.37,85.09 v19.37,90.33 21.43,92.39 62.71,92.39 71.28,83.82 71.28,78.11 74.93,74.45 74.93,61.44 78.74,57.63 v78.74,57.31
  Bottom 0.203: v149.86,36.67 148.75,36.67 IC3.3 | v123.67,35.72 v133.03,35.72 | v119.22,31.27 114.62,31.27 IC1.17 114.46,31.43 v111.6,31.43 | 85.88,57.31 85.88,56.99 87.79,55.09 v88.42,55.09 | 85.88,57.31 85.88,58.74 IC8.17 | v11.59,24.45 13.02,24.45 IC2.3 | v4.6,44.29 5.56,45.24 6.51,45.24 IC6.17 | v11.91,68.42 12.54,67.79 13.02,67.79 IC4.3 | v11.91,82.87 12.06,82.71 14.92,82.71 15.08,82.55 IC5.3 15.24,82.55 16.51,82.55 v16.67,82.39 | v19.37,90.33 23.34,94.3 24.92,94.3 24.92,93.19 IC7.17 | v78.74,57.31 85.88,57.31
A3
  Top 0.203: ANLGDAISY-MAIN.2 147.64,51.75 147.64,51.12 153.03,45.72 153.03,43.02 153.83,42.23 163.19,42.23 164.47,43.5 U1.A3
A4
  Bottom 0.203: ANLGDAISY-MAIN.3 145.1,49.21 149.54,44.77 151.29,44.77 153.83,42.23 160.66,42.23 161.93,43.5 U1.A4
A5
  Top 0.203: ANLGDAISY-MAIN.4 145.1,51.91 145.73,51.91 147,53.18 149.54,53.18 159.07,43.66 159.38,43.66 U1.A5
A12  (via drill 0.41)
  Top 0.203: U1.A12 139.22,43.66 139.22,48.58 139.86,49.21 ANLGDAISY-MAIN.7 140.02,49.37 141.29,50.64 143.19,50.64 143.83,51.28 143.83,52.55 148.91,57.63 v148.91,61.12
  Bottom 0.203: v148.91,61.12 148.59,61.12 146.84,62.87 JOYSTICKS.2
A13
  Top 0.203: U1.A13 136.68,43.66 136.68,48.58 139.86,51.75 ANLGDAISY-MAIN.8 140.02,51.91 144.15,56.04 144.15,60.33 JOYSTICKS.3
A14
  Bottom 0.203: U1.A14 134.14,43.66 138.59,48.1 141.29,48.1 142.4,49.21 ANLGDAISY-MAIN.5 142.56,49.37 143.83,49.37 143.83,52.39 143.03,53.18 141.76,53.18 141.76,60.33 JOYSTICKS.5
A15
  Top 0.203: JOYSTICKS.6 141.76,63.02 142.56,63.02 143.83,64.29 147.16,64.29 148.11,63.34 148.11,57.47 142.56,51.91 ANLGDAISY-MAIN.6
  Bottom 0.203: U1.A15 131.6,43.66 138.59,50.64 141.29,50.64 142.4,51.75 ANLGDAISY-MAIN.6
AD0  (via drill 0.41)
  Top 0.203: v96.04,52.23 101.6,57.78 SW1.E | v113.98,52.23 116.2,54.45 U$66.4
  Bottom 0.203: C26.1 101.92,59.69 101.92,57.94 101.76,57.94 SW1.E | IC8.1 93.03,51.59 93.66,52.23 v96.04,52.23 v113.98,52.23
AN2
  Bottom 0.203: ANLGDAISY-MAIN.1 147.64,49.21 152.08,44.77 165.89,44.77 167,43.66 U1.A2
D2  (via drill 0.41)
  Top 0.203: v88.42,60.17 88.42,58.58 96.68,50.32 96.68,48.26 103.03,41.91 105.89,41.91 v109.06,45.09
  Bottom 0.203: v88.42,60.17 88.42,58.9 IC8.21 | v109.06,45.09 109.54,45.56 110.81,45.56 IC9.12
D3  (via drill 0.41)
  Top 0.203: v92.08,60.17 92.39,60.17 92.87,59.69 104.3,59.69 v105.09,60.48 | SW1.A 106.68,72.23 109.06,69.85 109.22,69.85 113.98,65.09 113.98,59.37 116.2,57.15 U$66.3
  Bottom 0.203: U$66.3 116.2,57.15 113.82,59.53 108.11,59.53 106.36,61.28 C25.1 106.2,61.28 105.89,61.28 v105.09,60.48 | v92.08,60.17 89.22,60.17 89.22,58.9 IC8.22
D22  (via drill 0.41)
  Top 0.203: v150.34,86.04 v169.23,67.15
  Bottom 0.203: v169.23,67.15 169.23,50.32 174.78,44.77 201.14,44.77 201.45,44.45 R7.2 | v150.34,86.04 147.96,88.42 129.86,88.42 129.06,89.22 U1.22
D23  (via drill 0.41)
  Top 0.203: v140.97,77.47 136.37,82.07 v136.37,85.57
  Bottom 0.203: v140.97,77.47 151.13,77.47 151.13,64.77 168.28,47.62 169.86,47.62 175.26,42.23 201.45,42.23 203.52,44.29 R8.2 | v136.37,85.57 133.99,87.95 127.79,87.95 126.52,89.22 U1.23
D37  (via drill 0.41)
  Top 0.203: v140.02,77.47 v137.32,74.77
  Bottom 0.203: 205.42,87.63 204.95,87.63 CONF-A1.1 | 205.42,87.63 206.38,87.63 207.01,87 R9.2 207.17,86.84 210.19,83.82 210.98,83.82 CONF.3 | v137.32,74.77 136.37,74.77 131.76,70.17 127.79,70.17 126.52,71.44 U1.37 | v140.02,77.47 142.72,80.17 164.47,80.17 173.04,88.74 204.31,88.74 205.42,87.63
GND  (via drill 0.51)
  Top 0.203: v5.87,43.18 5.87,34.13 v8.89,31.11
  Top 0.356: v123.67,29.84 123.67,25.56 123.83,25.4 B7.P$4 123.83,25.24 123.83,22.23 124.62,21.43 v124.62,20.8 | v146.84,28.26 146.84,25.4 B8ALT.P$4 | v154.78,21.59 154.78,25.08 154.46,25.4 B9.P$4 | U$7.P$1 217.96,10 217.96,15.24 207.8,25.4 B12ALT.P$4 | v78.58,21.59 78.58,25.08 78.26,25.4 B4.P$4 78.11,25.56 78.11,30.96 71.12,37.94 71.12,39.85 JP3.1 | 117.63,17.62 117.63,24.13 116.36,25.4 B6ALT.P$4 | 117.63,17.62 117.63,17.3 116.05,15.72 116.05,10 U$15.P$1 | v14.29,17.3 14.29,16.99 9.92,12.62 | 9.92,12.62 7.3,10 5.08,10 U$20.P$1 | 9.92,12.62 1.75,20.8 1.75,30.96 U$34.L3 | v122.08,19.84 119.86,17.62 117.63,17.62 | U1.GND@3 126.52,48.58 128.91,48.58 U1.GND@2 | JOYSTICKS.8 139.22,63.02 139.22,64.61 146.37,71.75 SERIAL2.1 | UART1.5 143.19,82.07 143.19,79.53 147.96,74.77 147.96,73.34 146.53,71.91 SERIAL2.1 | 209.71,80.64 210.98,80.64 RESET.1 | 209.71,80.64 208.6,80.64 RESETA.1 208.44,80.49 208.44,77.31 204.31,73.18 204.31,51.75 205.58,50.48 U$1.K1 | 209.71,80.64 209.71,84.3 210.98,85.57 210.98,88.74 CONF.1 | 181.13,43.5 182.25,43.5 U1.GND@0 | 181.13,43.5 179.86,43.5 U1.GND@1 | 181.13,43.5 v181.13,45.56 173.67,45.56 147,72.23 SERIAL2.1 | JP4.1 32.38,41.91 32.38,46.99 B13.P$4 | v93.82,43.18 93.82,46.67 93.5,46.99 B17.P$4 | B18.P$4 108.58,46.99 106.68,48.9 106.68,57.78 SW1.D 106.68,57.94 106.68,66.99 108.27,68.58 B24.P$4 | U$21.P$1 5.08,89.85 8.1,89.85 16.35,81.6 v16.35,75.41 16.35,71.75 14.21,69.61 | 12.22,61.28 12.22,67.63 14.21,69.61 | 12.22,61.28 v12.22,46.67 | v11.91,61.28 12.22,61.28 | v33.5,63.98 33.5,67.63 32.54,68.58 B19.P$4 | v78.74,63.98 78.74,68.1 78.26,68.58 B22.P$4 | 117.47,90.01 117.47,92.23 116.05,93.66 U$18.P$1
  Top 0.356: 117.47,90.01 PC2.- | SSW2.1 110.97,83.66 117.32,90.01 117.47,90.01 | B23.P$4 100.33,68.58 103.98,72.23 SW1.C 104.14,72.39 v101.44,75.09 101.28,75.09 100.17,76.2 96.36,76.2 SSW2.3 96.2,76.2 95.09,75.09 93.98,75.09 93.5,75.56 93.5,75.72 93.27,75.96 | 93.27,75.96 91.44,77.79 91.44,83.5 SSW1.1 | B26.P$4 38.58,76.2 v36.51,78.26 36.51,78.42 32.54,82.39 32.54,83.82 B25.P$4 | SSW1.3 76.99,76.2 B29.P$4 84.45,76.04 85.88,74.61 91.92,74.61 93.27,75.96 | v60.64,88.9 60.64,87 63.02,84.61 63.02,77.63 62.79,77.39 | 62.79,77.39 61.59,76.2 B27ALT.P$4 | B21.P$4 62.87,68.58 62.87,77.31 62.79,77.39 | v14.13,69.69 14.21,69.61 | v123.67,90.96 123.67,78.9 123.51,78.74 SERIAL1.1
  Bottom 0.203: v5.87,43.18 5.4,43.18 5.4,44.29 5.71,44.61 6.51,44.61 IC6.16 | v8.89,31.11 7.14,29.37 6.99,29.37 6.91,29.29
  Bottom 0.305: C21.1 25.57,84.37 26.16,84.96 26.16,85.88 IC7.10 | IC6.10 15.25,46.63 C15.1 | C30.1 86.53,49.7 87.12,50.29 87.12,51.47 IC8.10 | C4.1 123.41,32.04 122.81,32.64 121.76,32.64 IC1.10
  Bottom 0.356: IC3.2 148.75,37.31 148.75,37.78 IC3.1 148.59,37.94 145.89,37.94 | 145.89,37.94 144.62,39.21 C8.2 | IC3.23 142.88,34.61 142.24,34.61 141.92,34.92 141.92,35.88 142.88,35.88 IC3.25 143.03,35.88 145.89,35.88 | 147.96,29.53 148.43,29.53 148.59,29.37 IC3.14 | 147.96,29.53 147.8,29.69 147.8,35.24 148.59,35.24 IC3.5 148.75,35.4 148.75,35.88 IC3.4 148.59,35.88 145.89,35.88 | 145.89,35.88 145.89,37.94 | v123.67,29.84 123.67,31.91 C4.1 | B7.P$4 123.98,25.4 124.14,25.56 131.44,25.56 B7ALT.P$4 131.6,25.4 131.76,25.56 138.91,25.56 139.06,25.4 B8.P$4 139.06,25.56 146.53,25.56 146.69,25.4 B8ALT.P$4 146.84,25.4 147,25.56 154.31,25.56 B9.P$4 154.46,25.4 154.62,25.56 161.93,25.56 B9ALT.P$4 162.08,25.4 162.24,25.56 169.39,25.56 169.54,25.4 B10.P$4 169.54,25.56 177.01,25.56 177.16,25.4 B10ALT.P$4 177.16,25.56 184.63,25.56 184.78,25.4 B11.P$4 184.78,25.56 192.25,25.56 192.41,25.4 B11ALT.P$4 192.41,25.56 199.87,25.56 200.03,25.4 B12.P$4 200.03,25.56 207.49,25.56 207.65,25.4 B12ALT.P$4 | v146.84,28.26 147.96,29.37 147.96,29.53 | v154.78,21.59 154.46,21.59 153.67,20.8 C18.2 | C16.2 126.05,11.43 124.62,10 116.05,10 U$15.P$1 | v78.58,21.59 78.26,21.59 77.47,20.8 C17.2 | IC1.16 114.46,30.64 114.46,30.16 IC1.15 114.3,30.16 113.19,29.05 102.39,29.05 101.12,27.78 101.12,25.4 B5ALT.P$4 | B5ALT.P$4 101.28,25.56 108.43,25.56 108.58,25.4 B6.P$4 108.58,25.56 116.05,25.56 116.2,25.4 B6ALT.P$4 | B5ALT.P$4 100.97,25.56 93.66,25.56 93.5,25.4 B5.P$4 93.34,25.4 93.19,25.56 86.04,25.56 85.88,25.4 B4ALT.P$4 85.72,25.56 78.42,25.56 78.26,25.4 B4.P$4 78.11,25.56 70.48,25.56 B3ALT.P$4 70.48,25.4 70.33,25.56 62.87,25.56 B3.P$4 62.87,25.4 62.71,25.56 55.24,25.56 B2ALT.P$4 55.24,25.4 55.09,25.56 47.62,25.56 B2.P$4 47.62,25.4 47.47,25.56 40.01,25.56 B1ALT.P$4 40.01,25.4 39.85,25.56 32.7,25.56 32.54,25.4 B1.P$4 32.38,25.56 13.18,25.56
  Bottom 0.356: v14.29,17.3 13.18,17.3 IC2.14 | 6.35,23.81 6.35,22.86 6.67,22.54 7.14,22.54 IC2.23 | 6.35,23.81 7.14,23.81 IC2.25 | 13.18,25.56 13.18,25.72 IC2.1 13.02,25.88 11.43,27.46 8.89,27.46 C5.2 8.73,27.46 6.91,29.29 6.27,29.92 | 13.18,25.56 13.18,25.24 IC2.2 | 6.27,29.92 5.24,30.96 3.81,30.96 U$34.L2 3.65,30.96 1.75,30.96 U$34.L3 | 6.35,23.81 6.35,26.51 6.19,26.67 6.19,29.84 6.27,29.92 | v124.62,20.8 123.67,19.84 v122.08,19.84 | U1.GND@2 129.06,48.74 130.65,48.74 134.78,52.86 C2.2 134.94,53.02 136.68,53.02 C1.2 136.84,53.18 137.64,53.98 137.64,59.21 135.89,59.21 135.57,59.53 135.57,60.96 137.32,60.96 139.22,62.87 JOYSTICKS.8 | U1.GND@4 196.69,91.76 199.07,89.38 210.5,89.38 210.98,88.9 CONF.1 | U$1.K1 205.58,50.32 205.58,49.69 203.36,47.47 201.29,47.47 200.82,46.99 186.06,46.99 184.78,45.72 C3.2 184.63,45.72 182.56,45.72 C6.2 182.4,45.56 v181.13,45.56 | JP4.4 30.48,47.47 31.91,47.47 32.38,46.99 B13.P$4 32.54,46.99 32.7,47.15 47.62,47.15 B14.P$4 47.78,46.99 47.94,47.15 55.09,47.15 55.24,46.99 B14ALT.P$4 55.24,47.15 62.71,47.15 62.87,46.99 B15.P$4 63.02,46.99 66.75,43.26 | JP4.1 31.27,40.8 36.67,40.8 38.1,42.23 C19.2 | 66.75,43.26 67.63,42.39 68.58,42.39 70.96,40.01 JP3.1 | 66.75,43.26 JP3.4 73.18,49.69 75.56,49.69 78.11,47.15 B16.P$4 78.26,46.99 79.69,45.56 79.85,45.56 POT1.3 80.01,45.56 80.17,45.56 84.14,49.53 C30.1 86.52,49.37 88.74,47.15 93.34,47.15 B17.P$4 93.5,46.99 93.66,47.15 100.81,47.15 100.97,46.99 B17ALT.P$4 101.12,46.99 101.6,47.47 107.95,47.47 108.43,46.99 B18.P$4 108.58,46.99 108.58,45.72 108.27,45.4 108.27,44.29 110.81,44.29 IC9.11 110.97,44.29 111.44,43.81 112.08,43.81 113.27,42.62
  Bottom 0.356: v93.82,43.18 93.5,43.18 92.71,42.39 C20.2 | C26.2 106.2,59.69 C25.2 106.2,59.53 106.2,57.94 106.52,57.94 SW1.D 106.68,57.63 107.16,57.15 113.67,57.15 U$66.1 | C27.2 117,50.01 117,48.26 IC9.1 116.84,48.1 116.36,47.62 115.73,47.62 115.57,47.47 115.57,45.24 115.73,45.24 115.73,45.09 | 114.3,40.96 112.39,40.96 111.6,41.75 110.97,41.75 IC9.9 | 114.3,40.96 116.52,40.96 116.84,40.64 IC9.7 | 114.54,41.35 114.3,41.12 114.3,40.96 | 114.54,41.35 115.73,42.55 116.36,42.55 116.84,43.02 IC9.5 | 114.54,41.35 113.27,42.62 | 115.73,45.09 116.36,45.09 116.84,45.56 IC9.3 | 113.27,42.62 115.73,45.09 | IC7.15 23.65,93.03 23.65,88.11 24.92,88.11 26.19,86.84 26.19,86.04 IC7.10 | 8.26,81.76 8.26,81.92 9.21,81.92 IC5.25 9.37,81.92 9.84,81.92 10,82.07 14.29,82.07 14.45,81.92 15.08,81.92 IC5.4 15.24,81.76 15.24,81.6 | 8.26,81.76 8.26,80.96 8.57,80.64 9.21,80.64 IC5.23 | 15.24,81.6 15.24,81.28 IC5.5 | 16.83,83.19 16.99,83.19 17.46,82.71 | 16.83,83.19 15.24,83.19 IC5.2 | 17.46,82.71 17.46,81.6 15.24,81.6 | C14.2 11.11,85.25 11.91,84.45 15.72,84.45 16.83,83.34 16.83,83.19 | 17.46,82.71 24.13,82.71 25.56,84.14 C21.1 | IC4.25 7.14,66.99 6.35,66.99 6.35,66.04 6.67,65.72 7.14,65.72 IC4.23 7.3,65.72 8.26,65.72 8.26,64.77 11.83,61.2 | 11.83,61.2 12.38,60.64 12.86,60.64 13.02,60.48 IC4.14 | v16.35,75.41 15.24,75.41 IC5.14 | v12.22,46.67 13.65,46.67 IC6.10 | v11.91,61.28 11.83,61.2 | 8.26,81.76 6.19,81.76 5.08,82.87 5.08,89.85 U$21.P$1 | 13.97,69.69 13.97,70.48 C9.2 | 13.97,69.69 13.97,68.74 | 13.97,68.74 13.97,68.58 13.81,68.42 13.18,68.42 IC4.2 | v33.5,63.98 34.13,63.98 34.61,63.5 C13.2 | 13.97,68.74 32.23,68.74 32.38,68.58 B19.P$4 32.54,68.58 32.7,68.74 47.62,68.74 B20.P$4 47.78,68.58 47.94,68.74 55.09,68.74 55.24,68.58 B20ALT.P$4 55.24,68.74 62.71,68.74 62.87,68.58 B21.P$4 62.87,68.74 70.33,68.74 70.48,68.58 B21ALT.P$4 70.48,68.74 77.95,68.74 78.11,68.58 B22.P$4
  Bottom 0.356: v78.74,63.98 79.38,63.98 79.85,63.5 C12.2 | SERIAL3.1 115.73,78.74 110.97,83.5 SSW2.1 110.81,83.66 108.9,83.66 108.74,83.82 B30.P$4 108.58,83.98 106.84,85.72 98.74,85.72 96.52,83.5 91.44,83.5 SSW1.1 | B24.P$4 107.63,68.58 106.36,69.85 C24.2 106.2,70.01 103.98,72.23 SW1.C | v101.44,75.09 100.65,75.09 100.17,75.56 C23.2 | v36.51,78.26 35.4,78.26 35.08,78.58 C11.2 | B26.P$4 38.73,76.2 38.89,76.04 46.04,76.04 46.2,76.2 B26ALT.P$4 46.35,76.2 46.51,76.04 53.66,76.04 53.82,76.2 B27.P$4 57.78,76.2 57.94,76.04 61.59,76.04 B27ALT.P$4 61.59,76.2 61.75,76.04 68.9,76.04 69.06,76.2 B28.P$4 69.22,76.04 76.68,76.04 76.83,76.2 SSW1.3 | C22.2 80.64,75.56 81.28,76.2 B29.P$4 84.14,76.36 84.14,78.58 C10.2 | v60.64,88.9 60.64,90.17 C7.2 | v14.13,69.69 13.97,69.69 | v123.67,90.96 127.16,94.46 156.53,94.46 156.53,88.58 148.75,80.8 144.46,80.8 143.19,82.07 UART1.5
  Bottom 0.406: SERIAL3.1 SERIAL1.1
  pour Top: 0,0 223.52,0 223.52,100.33 0,100.33
  pour Bottom: 0,0 223.52,0 223.52,100.33 0,100.33
GPA0  (via drill 0.41)
  Top 0.203: v117,33.97 117,36.04 v119.06,38.1 | v120.33,38.73 126.68,38.73 137.79,27.62 137.79,19.05 139.06,17.78 B8.P$5
  Bottom 0.203: v117,33.97 114.62,33.97 IC1.21 | v119.06,38.1 119.7,38.73 v120.33,38.73 | B8ALT.P$5 143.99,17.78 143.83,17.62 139.38,17.62 139.22,17.78 B8.P$5
GPA0_2  (via drill 0.41)
  Top 0.203: v77.95,84.61 82.23,80.33 82.23,79.22 83.98,77.47 87.15,77.47 88.58,76.04 91.28,76.04 SSW1.2
  Bottom 0.203: v77.95,84.61 75.09,87.47 47.78,87.47 46.2,89.06 27.62,89.06 27.62,93.03 IC7.21
GPA1  (via drill 0.41)
  Top 0.203: v119.22,33.81 117.16,31.75 117.16,28.42 117,28.26 117,27.62 119.22,25.4 119.86,25.4 123.83,21.43 123.83,17.78 B7.P$5
  Bottom 0.203: v119.22,33.81 118.27,34.77 116.84,34.77 116.68,34.61 114.62,34.61 IC1.22 | B7.P$5 B7ALT.P$5
GPA1_2  (via drill 0.41)
  Top 0.203: v94.14,92.71 96.68,92.71 107.79,81.6 v107.79,80.8
  Bottom 0.203: v94.14,92.71 37.62,92.71 36.99,92.08 28.26,92.08 28.26,93.03 IC7.22 | v107.79,80.8 111.12,77.47 111.12,76.04 110.97,76.04 SSW2.2
GPA2  (via drill 0.41)
  Top 0.203: v112.39,33.97 112.39,28.73 111.6,27.94 111.6,25.72 109.38,23.5 109.38,18.41 108.74,17.78 B6.P$5
  Bottom 0.203: v112.39,33.97 113.67,35.24 114.46,35.24 IC1.23 | B6.P$5 B6ALT.P$5
GPA3  (via drill 0.41)
  Top 0.203: v103.35,30.8 99.54,26.99 99.54,19.21 100.97,17.78 B5ALT.P$5
  Bottom 0.203: v103.35,30.8 107.47,30.8 112.55,35.88 114.46,35.88 IC1.24 | B5ALT.P$5 B5.P$5
GPA4  (via drill 0.41)
  Top 0.203: v68.26,34.45 59.21,25.4 57.15,25.4 52.07,20.32 42.7,20.32 40.16,17.78 B1ALT.P$5
  Bottom 0.203: v68.26,34.45 68.74,34.92 110.01,34.92 111.6,36.51 114.46,36.51 IC1.25 | B1ALT.P$5 B1.P$5
GPA5  (via drill 0.41)
  Top 0.203: v109.86,34.13 v113.03,37.31 | v72.23,33.97 69.37,33.97 59.69,24.29 59.69,21.11 58.9,20.32 57.94,20.32 55.4,17.78 B2ALT.P$5
  Bottom 0.203: v113.03,37.31 114.46,37.31 IC1.26 | v109.86,34.13 109.06,33.34 93.66,33.34 93.5,33.5 89.22,33.5 89.06,33.34 88.74,33.34 88.11,33.97 v72.23,33.97 | B2ALT.P$5 B2.P$5
GPA6  (via drill 0.41)
  Top 0.203: v104.46,37.31 102.87,38.89 102.55,38.89 89.06,25.4 88.42,25.4 82.55,19.53 82.55,18.57 80.49,16.51 71.91,16.51 70.64,17.78 B3ALT.P$5
  Bottom 0.203: v104.46,37.31 109.06,37.31 109.86,38.1 113.19,38.1 113.35,37.94 114.46,37.94 IC1.27 | B3ALT.P$5 B3.P$5
GPA7  (via drill 0.41)
  Top 0.203: v102.71,38.1 90.17,25.56 90.17,21.11 89.38,20.32 88.42,20.32 85.88,17.78 B4ALT.P$5
  Bottom 0.203: v102.71,38.1 109.22,38.1 109.7,38.58 114.46,38.58 IC1.28 | B4ALT.P$5 B4.P$5
GPA8  (via drill 0.41)
  Top 0.203: v117.63,39.53 117.63,44.77 v111.76,50.64 | v93.34,49.21 93.34,48.74 90.17,45.56 90.17,42.7 89.38,41.91 85.72,41.91 82.87,44.77 82.55,44.77 78.26,40.48 78.26,39.37 B16.P$5
  Bottom 0.203: v117.63,39.53 120.65,39.53 121.6,38.58 IC1.1 | v111.76,50.64 94.77,50.64 v93.34,49.21
GPA9  (via drill 0.41)
  Top 0.203: v133.03,34.77 v128.91,38.89 | v119.38,28.1 v125.73,34.45 | v100.33,26.83 v101.92,26.83 | v84.77,30 80.17,30 v71.91,38.26
  Bottom 0.203: v128.91,38.89 123.51,38.89 122.56,37.94 121.76,37.94 IC1.2 | v133.03,34.77 132.72,34.45 v125.73,34.45 | v119.38,28.1 119.38,26.83 v101.92,26.83 | v100.33,26.83 97.16,30 v84.77,30 | v71.91,38.26 71.6,38.58 63.82,38.58 63.02,39.37 B15.P$5
GPA10  (via drill 0.41)
  Top 0.203: v107.63,36.51 v110.49,39.37
  Bottom 0.203: v110.49,39.37 115.09,39.37 117.16,37.31 121.6,37.31 IC1.3 | v107.63,36.51 106.52,35.4 60.01,35.4 56.04,39.37 B14ALT.P$5 B14.P$5
GPA11  (via drill 0.41)
  Top 0.203: v115.89,36.67 114.14,36.67 111.28,33.81 v111.28,32.86 | v110.17,31.75 107.47,31.75 v107.31,31.91 | v40.64,34.45 v42.39,32.7
  Bottom 0.203: v115.89,36.67 121.6,36.67 IC1.4 | v110.17,31.75 v111.28,32.86 | v107.31,31.91 82.55,31.91 81.76,32.7 v42.39,32.7 | v40.64,34.45 35.72,39.37 B13.P$5
GPA12  (via drill 0.41)
  Top 0.203: v120.17,35.88 116.68,32.38 116.68,30.96 116.52,30.8 116.52,27.15 v118.27,25.4 | v134.46,26.67 137.32,23.81 137.32,17.78 138.75,16.35 145.1,16.35 145.26,16.19 148.11,16.19 149.7,17.78 B9.P$5 B9ALT.P$5
  Bottom 0.203: v120.17,35.88 121.6,35.88 IC1.5 | v118.27,25.4 118.59,25.72 122.4,25.72 123.35,26.67 v134.46,26.67
GPA13  (via drill 0.41)
  Top 0.203: v138.91,27.46 v128.27,38.1 | v158.59,26.67 158.59,26.35 164.62,20.32 167,20.32 169.54,17.78 B10.P$5 B10ALT.P$5
  Bottom 0.203: v128.27,38.1 127,38.1 126.52,37.62 122.87,37.62 122.87,35.56 122.71,35.4 121.76,35.4 IC1.6 | v138.91,27.46 139.7,26.67 v158.59,26.67
GPA14  (via drill 0.41)
  Top 0.203: v119.22,32.86 119.22,32.23 118.43,31.43 118.43,30.96 v119.86,29.53 | v130.81,29.05 134.46,25.4 135.1,25.4 136.53,23.97 136.53,17.94 140.34,14.13 176.53,14.13 180.18,17.78 B11.P$5 B11ALT.P$5
  Bottom 0.203: v119.22,32.86 120.97,34.61 121.6,34.61 IC1.7 | v119.86,29.53 120.33,29.05 v130.81,29.05
GPA15  (via drill 0.41)
  Top 0.203: v130.81,30 130.02,29.21 130.02,21.91 135.57,16.35 137.48,16.35 140.18,13.65 191.29,13.65 195.42,17.78 B12.P$5
  Bottom 0.203: v130.81,30 129.22,30 124.62,34.61 122.87,34.61 122.87,34.29 122.56,33.97 121.76,33.97 IC1.8 | B12.P$5 B12ALT.P$5
GPA16  (via drill 0.41)
  Top 0.203: v5.08,47.94 5.08,48.9 4.29,49.69 v4.29,60.64 | v2.7,66.52 2.7,87.47 1.59,88.58 1.59,91.28 3.81,93.5 96.52,93.5 v109.22,80.8
  Bottom 0.203: v5.08,47.94 6.51,47.94 IC6.21 | v4.29,60.64 4.29,64.93 v2.7,66.52 | v109.22,80.8 109.22,80.01 113.67,75.56 113.67,69.22 113.51,69.22 112.24,67.94 112.24,60.96 B24.P$5
GPA17  (via drill 0.41)
  Top 0.203: v8.89,45.4 v8.89,48.58 | v87.31,56.52 v85.09,54.29
  Bottom 0.203: v8.89,48.58 6.67,48.58 IC6.22 | v8.89,45.4 11.91,42.39 19.53,42.39 20.95,43.81 22.23,43.81 23.97,45.56 23.97,52.39 71.75,52.39 73.66,54.29 v85.09,54.29 | v87.31,56.52 88.42,57.63 93.34,57.63 93.5,57.78 93.5,60.96 B23.P$5
GPA18  (via drill 0.41)
  Top 0.203: v24.45,37.31 v22.86,38.89 | v26.04,37.62 33.34,37.62 44.13,48.42 62.23,48.42 66.52,52.7 75.09,52.7 79.53,57.15 79.53,57.47 78.26,58.74 78.26,60.96 B22.P$5
  Bottom 0.203: v22.86,38.89 22.23,38.89 19.37,41.75 6.19,41.75 4.29,43.66 3.81,43.66 3.81,47.62 5.4,49.21 6.51,49.21 IC6.23 | v24.45,37.31 24.77,37.62 v26.04,37.62
GPA19  (via drill 0.41)
  Top 0.203: v5.08,52.7 v5.08,49.85
  Bottom 0.203: v5.08,49.85 6.51,49.85 IC6.24 | v5.08,52.7 7.46,55.09 9.05,55.09 9.37,54.77 14.29,54.77 14.92,55.4 24.13,55.4 24.61,55.88 66.52,55.88 70.48,59.85 70.48,60.96 | 70.48,60.96 B21.P$5 | 70.48,60.96 B21ALT.P$5
GPA20  (via drill 0.41)
  Top 0.203: v93.34,32.7 93.34,39.37 B17.P$5 B17ALT.P$5
  Bottom 0.203: v93.34,32.7 88.74,32.7 87.95,33.5 73.82,33.5 73.5,33.18 72.07,33.18 71.6,33.66 26.19,33.66 21.91,37.94 2.7,37.94 2.7,48.42 4.92,50.64 6.51,50.64 IC6.25
GPA21  (via drill 0.41)
  Top 0.203: v94.14,85.09 94.14,76.04 v94.3,75.88 | v91.92,73.5 91.92,66.2 v92.55,65.56 | v107.47,54.29 107.47,50.01 109.86,47.62 109.86,40.48 108.74,39.37 B18.P$5
  Bottom 0.203: v94.14,85.09 94.14,86.68 95.73,88.27 97.16,88.27 97.16,91.6 92.71,96.04 0.64,96.04 0.64,84.77 1.91,83.5 1.91,54.93 5.56,51.28 6.51,51.28 IC6.26 | v91.92,73.5 v94.3,75.88 | v92.55,65.56 96.68,61.44 96.68,55.09 106.68,55.09 v107.47,54.29
GPA22  (via drill 0.41)
  Top 0.203: v19.21,53.34 19.84,53.34 27.46,60.96 B19.P$5
  Bottom 0.203: v19.21,53.34 18.89,53.02 8.89,53.02 7.78,51.91 6.67,51.91 IC6.27
GPA23  (via drill 0.41)
  Top 0.203: v22.86,54.13 26.04,57.31 41.91,57.31 45.56,60.96 B20.P$5
  Bottom 0.203: v22.86,54.13 19.05,54.13 18.41,53.5 7.62,53.5 6.67,52.55 IC6.28 | B20.P$5 B20ALT.P$5
GPA26  (via drill 0.41)
  Top 0.203: v82.07,65.56 v78.9,62.39
  Bottom 0.203: v78.9,62.39 77.79,62.39 76.36,60.96 73.5,60.96 65.88,53.34 20.16,53.34 18.1,51.28 13.81,51.28 IC6.3 | v82.07,65.56 86.52,70.01 98.11,70.01 100.33,72.23 100.33,74.3 106.68,74.3 108.58,76.2 B30.P$5
GPA27  (via drill 0.41)
  Top 0.203: v22.86,50.64 25.88,50.64 30.64,55.4 59.21,55.4 64.77,60.96 64.77,62.71 65.56,63.5 66.52,63.5 69.22,66.2 69.22,74.45 70.48,75.72 v70.48,82.39
  Bottom 0.203: v22.86,50.64 13.81,50.64 IC6.4 | v70.48,82.39 71.91,83.82 B29.P$5
GPA28  (via drill 0.41)
  Top 0.203: v15.24,49.85 15.24,51.59 12.86,53.98 12.86,58.9 29.37,75.41 31.59,75.41 32.38,76.2 B25.P$5
  Bottom 0.203: v15.24,49.85 13.81,49.85 IC6.5
GPA29  (via drill 0.41)
  Top 0.203: v17.78,49.05 21.59,52.86 21.59,54.45 26.83,59.69 33.18,59.69 40.64,67.15 40.64,81.92 38.73,83.82 | 38.73,83.82 B26ALT.P$5 | 38.73,83.82 B26.P$5
  Bottom 0.203: v17.78,49.05 15.08,49.05 14.92,49.21 13.81,49.21 IC6.6
GPA30  (via drill 0.41)
  Top 0.203: v8.73,50.96 7.94,51.75 v7.94,54.29 | v24.61,54.93 24.92,54.93 26.83,56.83 49.37,56.83 50.96,58.42 50.96,59.37 56.52,64.93 56.52,70.33 56.04,70.8 56.04,81.76 53.98,83.82 B27.P$5
  Bottom 0.203: v8.73,50.96 11.11,48.58 13.65,48.58 IC6.7 | v7.94,54.29 14.45,54.29 15.08,54.93 v24.61,54.93 | B27.P$5 B27ALT.P$5
GPA31  (via drill 0.41)
  Top 0.203: v10,45.4 v10,48.1 | v13.81,43.18 26.51,55.88 53.18,55.88 58.26,60.96 58.9,60.96 64.77,66.83 64.77,69.69 66.2,71.12 66.2,75.88 69.06,78.74 69.06,83.82 B28.P$5
  Bottom 0.203: v10,48.1 12.86,48.1 13.02,47.94 13.65,47.94 IC6.8 | v10,45.4 12.22,43.18 v13.81,43.18
GPB0  (via drill 0.41)
  Top 0.203: v70.96,85.09 70.96,84.77 72.39,83.34 72.39,79.53 73.18,78.74 74.14,78.74 75.72,80.33 75.72,80.64 76.52,81.44 78.58,81.44 78.74,81.28 SSW1.8
  Bottom 0.203: v70.96,85.09 32.86,85.09 32.07,85.88 IC7.1
GPB1  (via drill 0.41)
  Top 0.203: v47.78,88.42 v46.83,87.47 | v94.93,84.3 95.25,84.3 98.27,81.28 SSW2.8
  Bottom 0.203: v46.83,87.47 31.43,87.47 31.43,86.04 IC7.2 | v47.78,88.42 48.1,88.11 76.36,88.11 76.52,88.27 90.01,88.27 93.98,84.3 v94.93,84.3
I2C_SCL  (via drill 0.41)
  Top 0.203: 10.95,40.16 10.95,42.86 12.54,44.45 12.54,45.24 v12.38,45.4 11.43,46.35 v11.43,51.12 | 10.95,40.16 v10.95,26.67 | v7.78,82.55 7.78,70.33 6.03,68.58 v6.03,67.79 10.32,63.5 v10.32,52.23 | v120.33,31.43 v125.41,36.51 | v117.79,59.69 117.79,60.01 118.11,60.33 118.11,69.85 SERIAL3.4 | v133.03,75.88 133.03,83.82 136.53,87.31 136.53,91.76 U1.21 | v115.09,29.21 115.09,34.92 116.68,36.51 116.68,41.91 109.06,49.53 v109.06,51.44 | 10.95,40.16 17.3,40.16 20.95,43.81 23.18,43.81 v23.97,44.61
  Bottom 0.203: v10.95,26.67 8.89,24.61 7.3,24.61 IC2.26 | v12.38,45.4 13.65,45.4 IC6.12 | v6.03,67.79 7.14,67.79 IC4.26 | IC5.26 9.21,82.55 v7.78,82.55 6.19,82.55 6.19,83.82 8.57,86.2 14.76,86.2 16.19,84.77 24.61,84.77 24.77,84.93 24.77,85.88 IC7.12 | v10.32,52.23 v11.43,51.12 | v125.41,36.51 142.88,36.51 IC3.26 | IC1.12 121.6,31.43 v120.33,31.43 118.11,29.21 v115.09,29.21 | R5.1 139.22,89.38 136.84,91.76 136.68,91.76 U1.21 | 115.73,53.02 116.68,53.02 117.79,54.13 v117.79,59.69 | 115.73,53.02 85.88,53.02 85.88,51.59 IC8.12 85.72,51.44 85.72,50.48 85.57,50.32 84.3,50.32 83.98,50.64 24.45,50.64 24.45,45.4 23.97,44.93 v23.97,44.61 | 133.03,75.72 132.87,75.72 129.86,72.71 124.94,72.71 123.51,71.28 SERIAL1.4 | 133.03,75.72 142.56,75.72 143.83,74.45 SERIAL2.4 | 133.03,75.72 v133.03,75.88 | v109.06,51.44 114.14,51.44 115.73,53.02
  Bottom 0.406: SERIAL3.4 SERIAL1.4
I2C_SDA  (via drill 0.41)
  Top 0.203: v10,26.67 10,42.86 v11.75,44.61 11.75,45.09 10.79,46.04 10.79,50.16 v10.64,50.32 | v9.37,87.47 9.37,85.09 v7.78,83.5 6.19,81.92 v6.19,69.69 5.24,68.74 5.24,67.63 8.73,64.14 8.73,55.4 8.89,55.24 v8.89,52.07 | U1.20 139.06,91.76 138.11,90.81 v138.11,87.63 137.48,87.63 133.83,83.98 133.83,75.72 133.19,75.09 132.56,75.09 131.6,76.04 131.29,76.04 130.33,75.09 130.33,71.91 | 130.33,71.91 129.54,72.71 124.46,72.71 123.51,73.66 SERIAL1.3 | 130.33,71.91 v132.72,69.53 | v120.33,30.48 v127.16,37.31 120.81,37.31 118.11,40.01 118.11,45.24 113.51,49.85 | 113.51,49.85 v109.54,53.82 | SERIAL3.3 116.84,73.03 115.57,71.75 115.57,59.69 117.63,57.63 117.63,53.98 113.51,49.85 | v18.41,44.77 21.59,47.94 24.45,47.94 30,53.5 v74.93,53.5
  Bottom 0.203: v10,26.67 8.57,25.24 7.3,25.24 IC2.27 | v11.75,44.61 13.65,44.61 IC6.13 13.81,44.77 v18.41,44.77 | v6.19,69.69 6.19,68.9 6.67,68.42 7.14,68.42 IC4.27 | v7.78,83.5 8.1,83.19 9.21,83.19 IC5.27 | v9.37,87.47 24.13,87.47 24.13,86.04 IC7.13 | v8.89,52.07 v10.64,50.32 | v138.11,87.63 139.06,87.63 139.22,87.47 R6.1 | v132.72,69.53 141.6,69.53 143.83,71.75 SERIAL2.3 | v127.16,37.31 142.72,37.31 142.88,37.15 IC3.27 | v120.33,30.48 120.49,30.64 121.6,30.64 IC1.13 | 85.25,53.5 85.25,51.59 IC8.13 | 85.25,53.5 109.22,53.5 v109.54,53.82 | 85.25,53.5 v74.93,53.5
  Bottom 0.406: SERIAL3.3 SERIAL1.3
L0
  Bottom 0.203: R23.1 37.15,22.86 35.88,24.13 B1ALT.P$2 B1.P$2
L1
  Bottom 0.203: R22.1 37.15,20.32 35.88,19.05 B1ALT.P$3 B1.P$3
L2
  Top 0.203: B2ALT.P$2 B2.P$2
  Bottom 0.203: B2ALT.P$2 51.12,24.13 52.39,22.86 R21.1
L3
  Top 0.203: B2ALT.P$3 B2.P$3
  Bottom 0.203: B2ALT.P$3 51.12,19.05 52.39,20.32 R20.1
L4
  Bottom 0.203: B3.P$2 58.74,24.13 60.01,22.86 R19.1 60.17,22.86 61.44,24.13 B3ALT.P$2
L5
  Bottom 0.203: B3.P$3 58.74,19.05 60.01,20.32 R18.1 60.17,20.32 61.44,19.05 B3ALT.P$3
L6
  Bottom 0.203: R17.1 72.07,22.86 73.34,24.13 B4.P$2 B4ALT.P$2
L7
  Bottom 0.203: R16.1 72.07,20.32 73.34,19.05 B4.P$3 73.98,19.37 80.96,19.37 B4ALT.P$3
L8
  Bottom 0.203: R15.1 87.31,22.86 88.58,24.13 B5.P$2 B5ALT.P$2
L9
  Bottom 0.203: R14.1 87.31,20.32 88.58,19.05 B5.P$3 B5ALT.P$3
L10
  Bottom 0.203: R13.1 102.55,22.86 103.82,24.13 B6.P$2 B6ALT.P$2
L11
  Bottom 0.203: R12.1 102.55,20.32 103.82,19.05 B6.P$3 B6ALT.P$3
L12
  Bottom 0.203: R11.1 117.79,22.86 119.06,24.13 B7.P$2 B7ALT.P$2
L13
  Bottom 0.203: R10.1 117.79,20.32 119.06,19.05 B7.P$3 B7ALT.P$3
L14
  Bottom 0.203: R4.1 133.03,22.86 134.3,24.13 B8.P$2 B8ALT.P$2
L15
  Bottom 0.203: R3.1 133.03,20.32 134.3,19.05 B8.P$3 B8ALT.P$3
L16
  Bottom 0.203: R39.1 148.27,22.86 149.54,24.13 B9.P$2 B9ALT.P$2
L17
  Top 0.203: B9ALT.P$3 B9.P$3
  Bottom 0.203: B9.P$3 149.54,19.05 148.27,20.32 R38.1
L18
  Top 0.203: B10ALT.P$2 B10.P$2
  Bottom 0.203: B10.P$2 164.78,24.13 163.51,22.86 R37.1
L19
  Bottom 0.203: R36.1 163.51,20.32 164.78,19.05 B10.P$3 B10ALT.P$3
L20
  Top 0.203: B11ALT.P$2 B11.P$2
  Bottom 0.203: B11.P$2 180.02,24.13 178.75,22.86 R35.1
L21
  Top 0.203: B11ALT.P$3 B11.P$3
  Bottom 0.203: B11.P$3 180.02,19.05 178.75,20.32 R34.1
L22
  Bottom 0.203: R33.1 193.99,22.86 195.26,24.13 B12.P$2 B12ALT.P$2
L23
  Bottom 0.203: R32.1 193.99,20.32 195.26,19.05 B12.P$3 B12ALT.P$3
L24
  Bottom 0.203: B13.P$2 25.72,45.72 25.4,45.4 R31.1
L25
  Bottom 0.203: B13.P$3 27.94,39.53 27.15,38.73 27.15,36.83 R30.1
L26
  Top 0.203: B14ALT.P$2 B14.P$2
  Bottom 0.203: B14ALT.P$2 51.12,45.72 52.39,44.45 R29.1
L27
  Top 0.203: B14ALT.P$3 B14.P$3
  Bottom 0.203: B14ALT.P$3 51.12,40.64 52.39,41.91 R28.1
L28
  Bottom 0.203: B15.P$2 58.74,45.72 60.01,44.45 R27.1
L29
  Bottom 0.203: B15.P$3 58.74,40.64 60.01,41.91 R26.1
L30
  Bottom 0.203: B16.P$2 73.98,45.72 75.25,44.45 R25.1
L31
  Bottom 0.203: B16.P$3 73.98,40.64 75.25,41.91 R24.1
L32
  Bottom 0.203: R55.1 87.31,44.45 88.58,45.72 B17.P$2 B17ALT.P$2
L33
  Top 0.203: B17ALT.P$3 B17.P$3
  Bottom 0.203: B17.P$3 88.58,40.64 87.31,41.91 R54.1
L34
  Bottom 0.203: B18.P$2 103.82,45.72 102.55,44.45 R53.1
L35
  Bottom 0.203: B18.P$3 103.82,40.64 102.55,41.91 R52.1
L36
  Bottom 0.203: B19.P$2 27.62,67.31 26.35,66.04 R51.1
L37
  Bottom 0.203: B19.P$3 27.62,62.23 26.35,63.5 R50.1
L38
  Top 0.203: B20ALT.P$2 B20.P$2
  Bottom 0.203: B20.P$2 42.86,67.31 41.59,66.04 R49.1
L39
  Bottom 0.203: R48.1 41.59,63.5 42.86,62.23 B20.P$3 B20ALT.P$3
L40
  Bottom 0.203: R47.1 56.83,66.04 58.1,67.31 B21.P$2 B21ALT.P$2
L41
  Bottom 0.203: R46.1 56.83,63.5 58.1,62.23 B21.P$3 B21ALT.P$3
L42
  Bottom 0.203: B22.P$2 73.34,67.31 72.07,66.04 R45.1
L43
  Bottom 0.203: B22.P$3 73.34,62.23 72.07,63.5 R44.1
L44
  Bottom 0.203: B23.P$2 88.58,67.31 87.31,66.04 R43.1
L45
  Bottom 0.203: B23.P$3 88.58,62.23 87.31,63.5 R42.1
L46
  Bottom 0.203: B24.P$2 103.19,66.36 100.01,66.36 100.01,61.91 R41.1
L47
  Bottom 0.203: B24.P$3 103.66,61.75 101.6,61.75 100.01,60.17 R40.1
L48
  Bottom 0.203: B25.P$2 27.62,82.55 26.35,81.28 R71.1
L49
  Bottom 0.203: B25.P$3 27.62,77.47 26.35,78.74 R70.1
L50
  Bottom 0.203: R69.1 41.59,78.74 42.86,77.47 B26.P$2 B26ALT.P$2
L51